# Altium schematic sheet Connector-SWIM.SchDoc: =ProjectTitle
size 297 x 209 mm; Address1: Address1; Address2: Address2; Address3: Address3; Address4: Address4; SheetNumber: 4; SheetTotal: 6; Scale: 1:1; DocumentType: Схема электрическая принципиальная
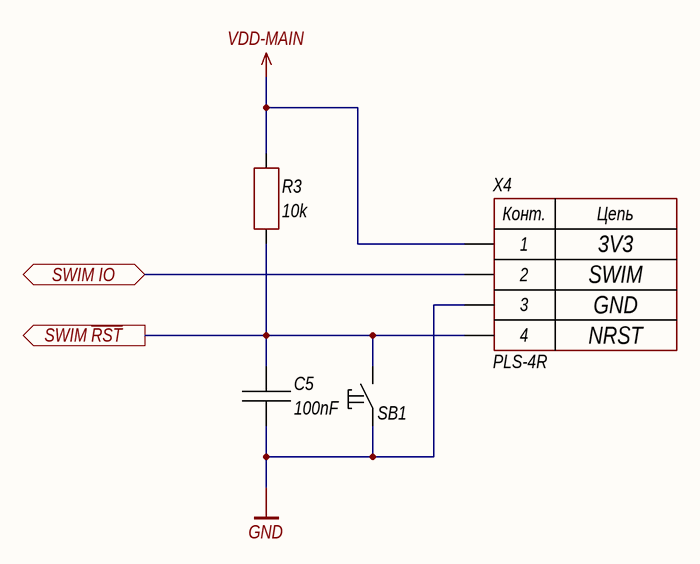
[diagram p0: Connector-SWIM.SchDoc]

## Parts
C5  100nF  [CH0402C]
R3  10k  [CH0402R]
SB1  "Кнопка"  [BUT: YTS-A017]  (value not drawn)
X4  PLS-4R  [CON: PLS-4]

## Ports
SWIM IO (bidir), SWIM ~{RST} (out)

## Nets
GND: C5.1 SB1.1 X4.3
VDD-MAIN: R3.2 X4.1
SWIM IO: X4.2 ; port SWIM IO
SWIM ~{RST}: C5.2 R3.1 SB1.2 X4.4 ; port SWIM ~{RST}

## Notes on the sheet
- 3V3
- GND
- SWIM
- NRST
- Изм.
- Лист
- № докум.
- Подп.
- Дата
- Копировал
- Формат А4
- (in symbol 4-Connector) Конт.; Цепь

## Library data of the parts
C5 = Capacitor: Manufacturer: CCTC; Model: TCC0402X7R104K250AT; HelpURL: https://lcsc.com/product-detail/Multilayer-Ceramic-Capacitors-MLCC-SMD-SMT_CCTC-TCC0402X7R104K250AT_C466234.html; ComponentKind: X7R, 50V; Value: 100nF
R3 = Resistor: Manufacturer: Uniroyal Elec; Model: 0402WGF1002TCE; HelpURL: https://lcsc.com/product-detail/Chip-Resistor-Surface-Mount_UNI-ROYAL-Uniroyal-Elec-0402WGF1002TCE_C25744.html; ComponentKind: ±1%; Value: 10k
SB1 = Tactile switches: 6x6 mm; Manufacturer: DGBZ; Model: YTSA017A0252501B; HelpURL: https://lcsc.com/product-detail/Tactile-Switches_DGBZ-YTSA017A0252501B_C967796.html; ComponentKind: SMT Tactile switch
X4 = 4-Connector: Model: PLS-4R; Manufacturer: *; HelpURL: *; ComponentKind: *